# Altium schematic sheet HTS221.SchDoc
size A4; Organization: Altium Limited; Address1: L3, 12a Rodborough Rd; Address2: Frenchs Forest; Address3: NSW; Address4: Australia 2086; SheetNumber: 8; SheetTotal: 10
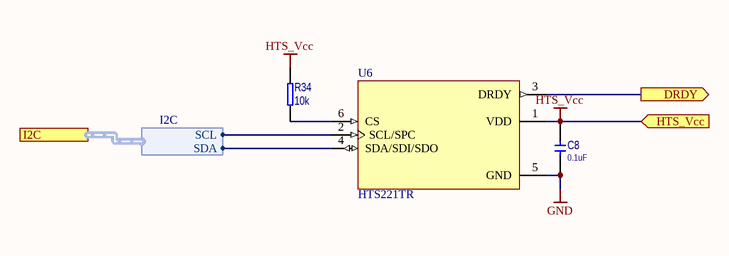
[diagram p0: HTS221.SchDoc]

## Parts
C8  value 0.1uF  [CERCAP 0402]
R34  value 10k  [RES 0402]
U6  HTS221TR  [LGA6_HTS221]

## Ports
DRDY (out), HTS_Vcc (in), I2C (harness I2C)

## Harnesses
I2C: SDA, SCL

## Nets
GND: C8.1 U6.5(GND)
HTS_Vcc: C8.2 R34.2 U6.1(VDD) ; port HTS_Vcc
DRDY: U6.3(DRDY) ; port DRDY
NetR34_1: R34.1 U6.6(CS)
NetU6_2: U6.2(SCL/SPC) ; port I2C.SCL
NetU6_4: U6.4(SDA/SDI/SDO) ; port I2C.SDA

## Notes on the sheet
- Title
- Size:
- Date:
- A4
- Number:
- Time:
- Revision:
- Sheet
- of
- File:

## Library data of the parts
C8 = !Capacitor: Capacitor; IsSMT: NoSMT; Diel: X7R; Voltage: *
R34 = !Resistor: Resistor; IsSMT: NoSMT
U6 = HTS221TR: Humidity Temperature Sensor 0 ~ 100% RH IÂ²C, SPI Â±4.5% RH 10s Surface Mount; MF: STMicroelectronics; SnapEDA_Link: https://www.snapeda.com/parts/HTS221TR/STMicroelectronics/view-part/231234/?ref=snap; MP: HTS221TR; Value: *; Digi-Key_Part_Number: 497-15382-1-ND; Digi-Key_Purchase_URL: https://www.digikey.co.za/product-detail/en/stmicroelectronics/HTS221TR/497-15382-1-ND/5180533?utm_source=snapeda&utm_medium=aggregator&utm_campaign=symbol; Package: VFLGA-6 STMicroelectronics; Order: HTS221TR